# EAGLE schematic pca9635 (EAGLE 7.3.0)
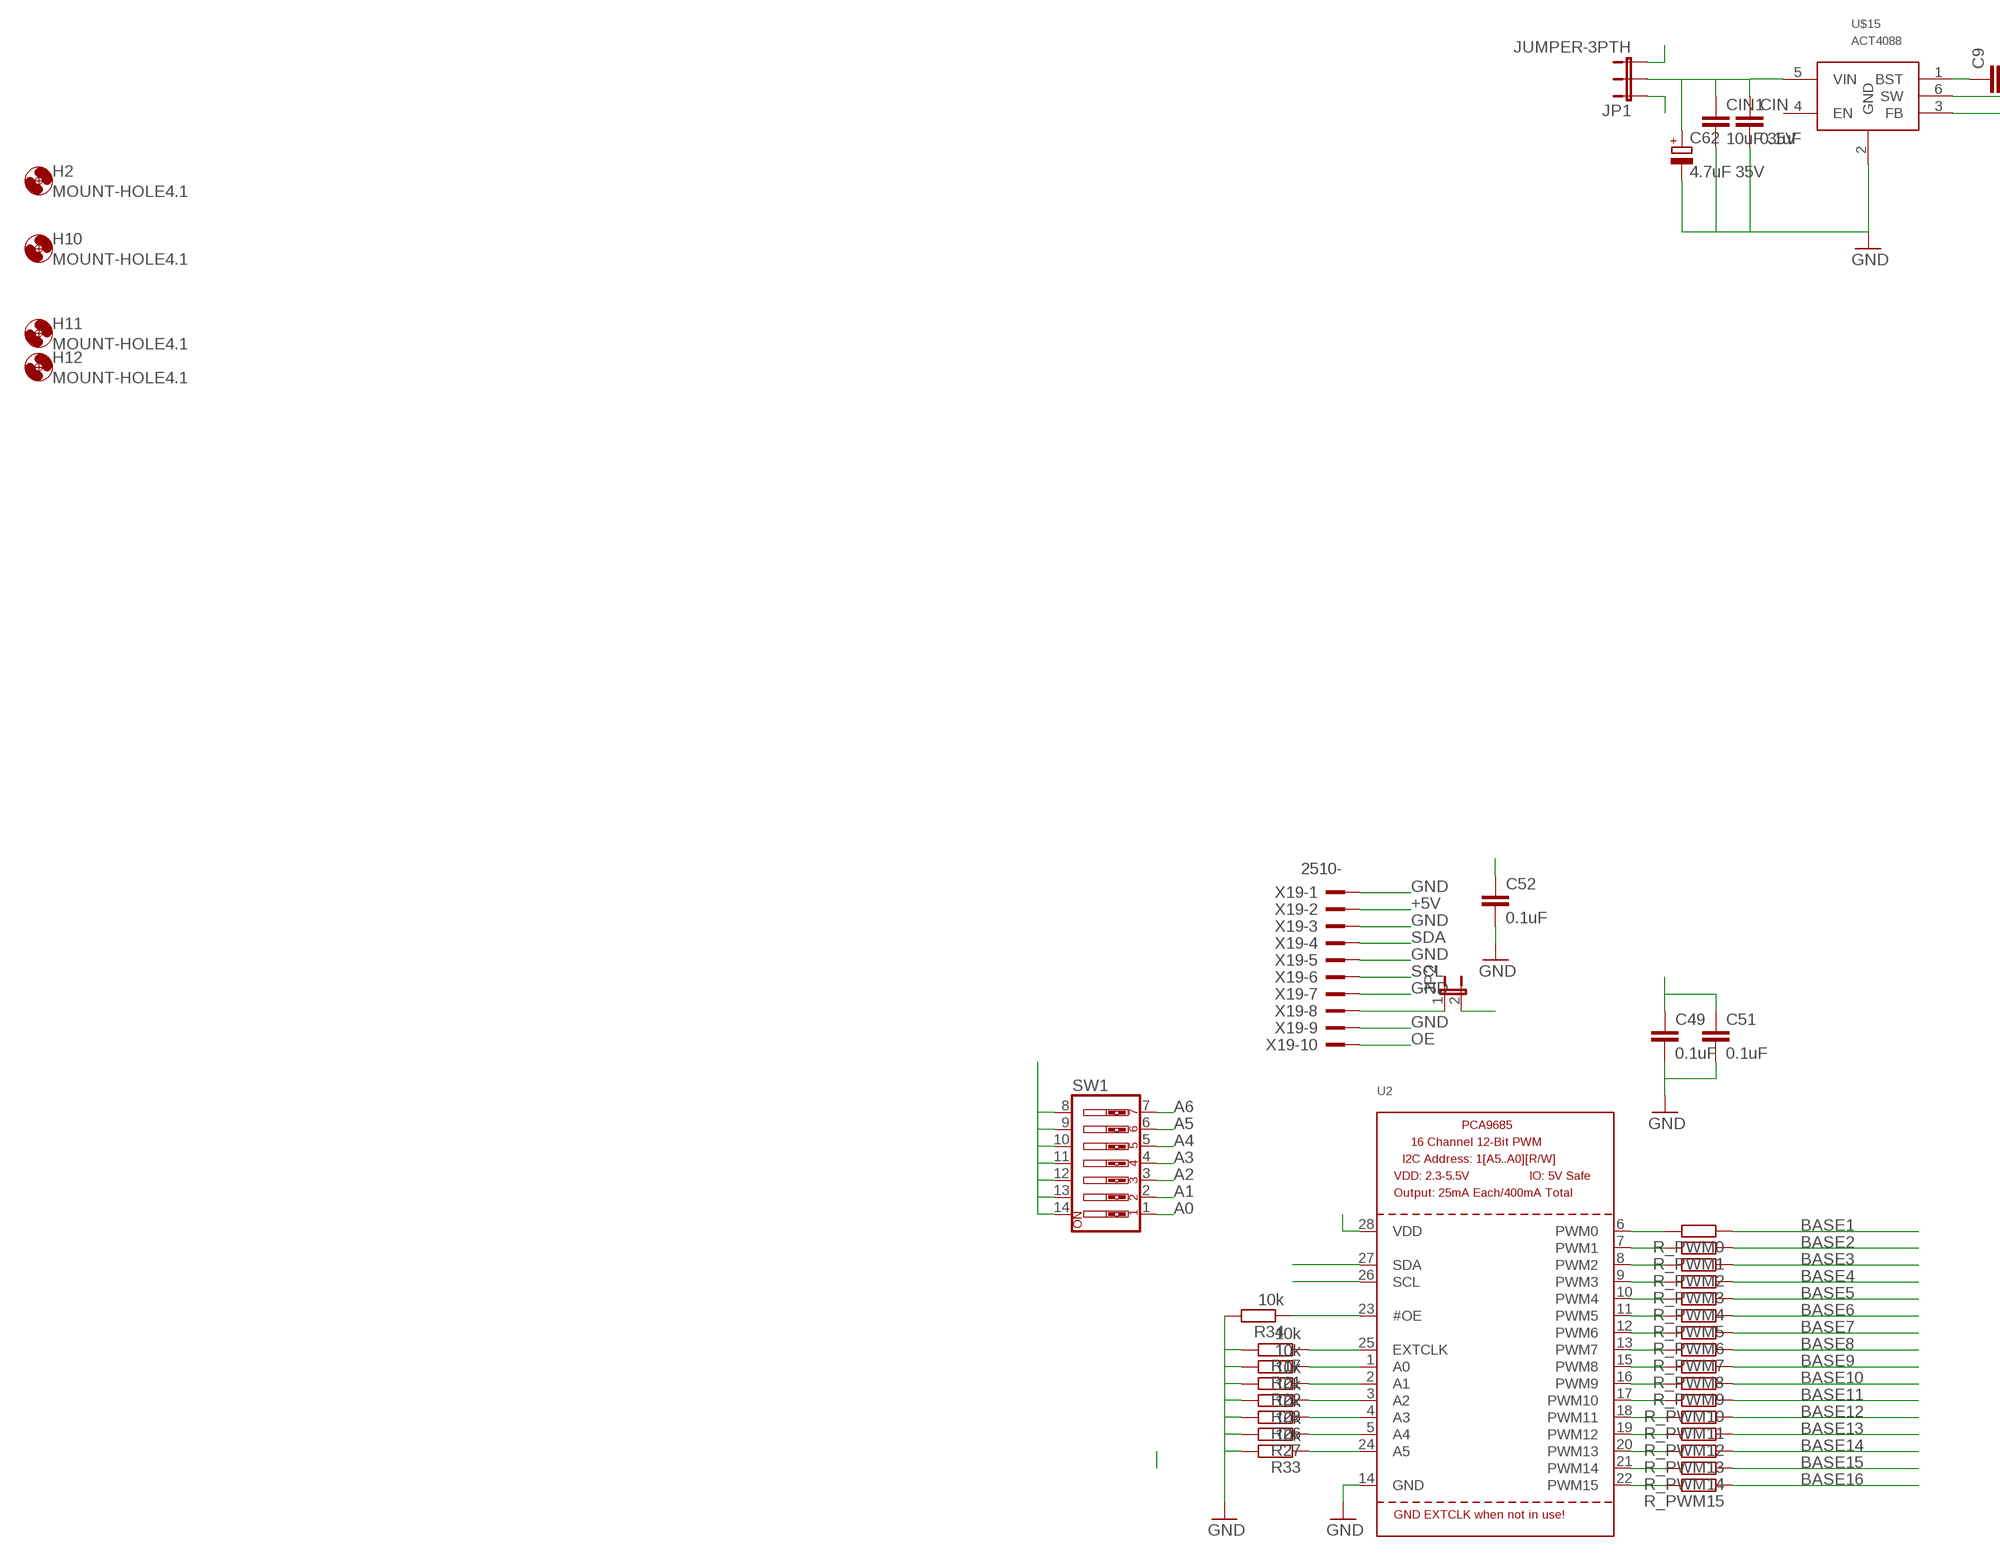
[diagram p0: schematic, sheet 1, part 1 of 2]
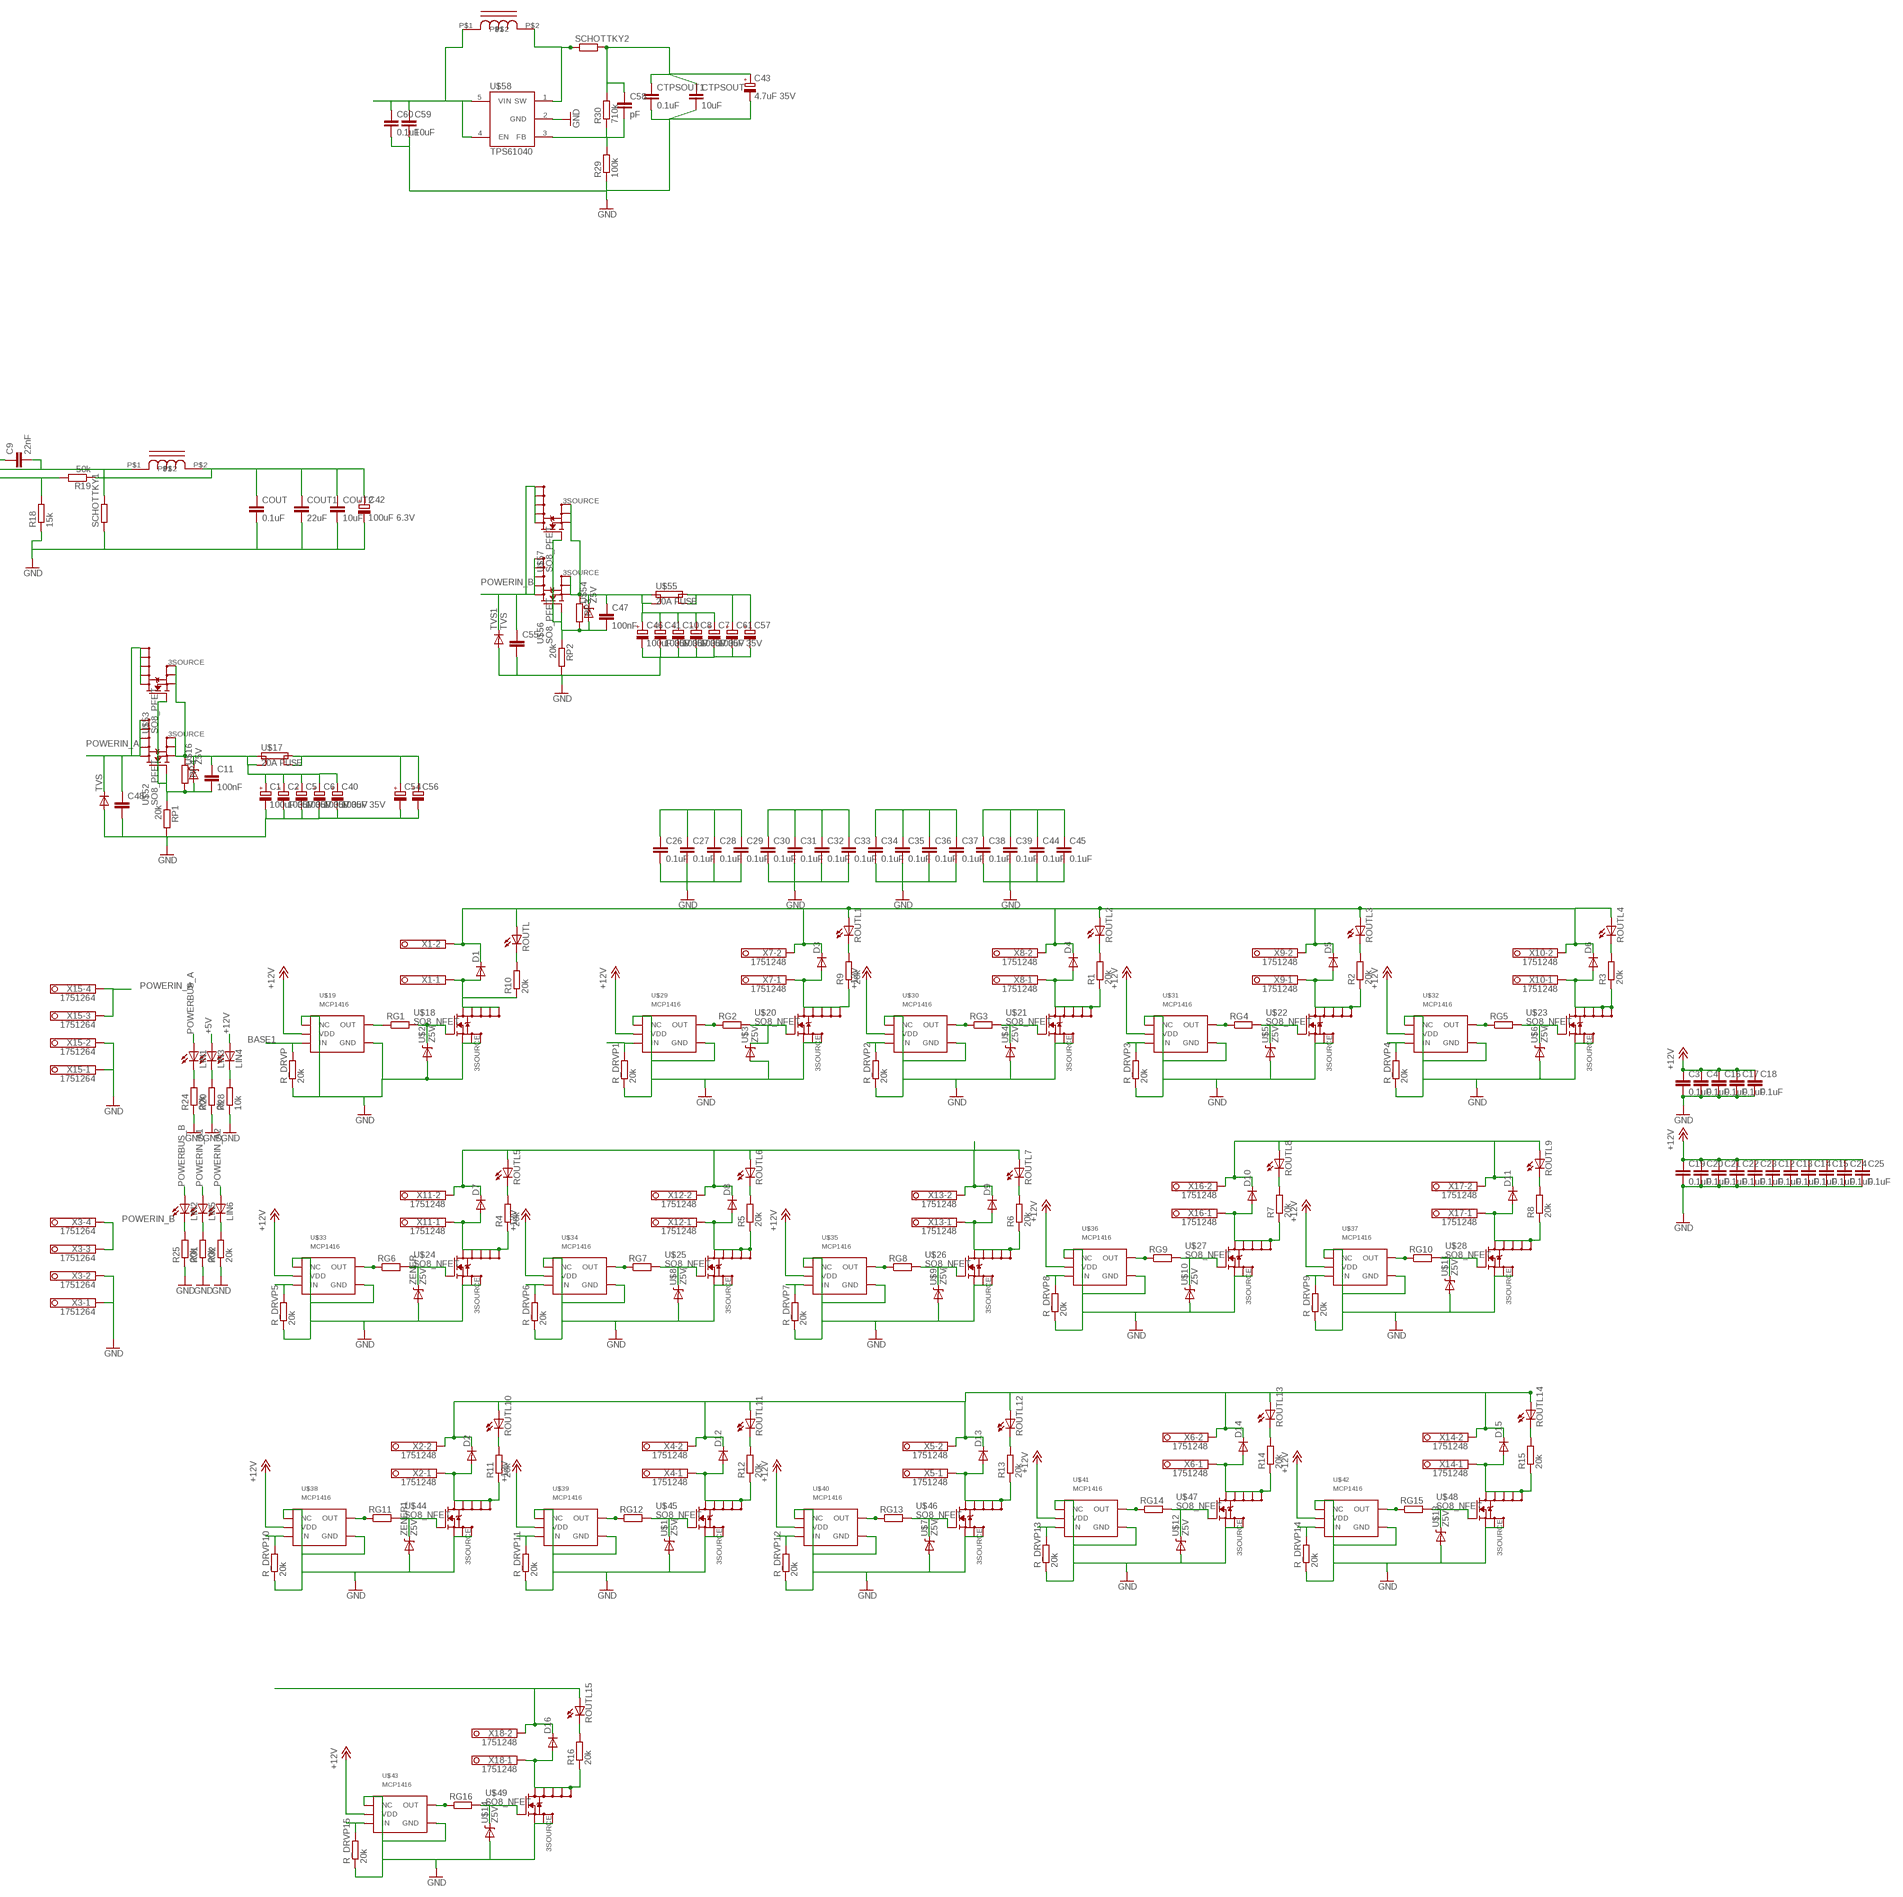
[diagram p1: schematic, sheet 1, part 2 of 2]

## Parts
C1  100uF 35V  CPOL-EUSMD_8X10_3.5HOLE  [SMD_8X10_3.5HOLE]
C2  100uF 35V  CPOL-EUSMD_8X10_3.5HOLE  [SMD_8X10_3.5HOLE]
C3  0.1uF  C-EUC0603  [C0603]
C4  0.1uF  C-EUC0603  [C0603]
C5  100uF 35V  CPOL-EUSMD_8X10_3.5HOLE  [SMD_8X10_3.5HOLE]
C6  100uF 35V  CPOL-EUSMD_8X10_3.5HOLE  [SMD_8X10_3.5HOLE]
C7  100uF 35V  CPOL-EUSMD_8X10_3.5HOLE  [SMD_8X10_3.5HOLE]
C8  100uF 35V  CPOL-EUSMD_8X10_3.5HOLE  [SMD_8X10_3.5HOLE]
C9  22nF  C-EUC0805  [C0805]
C10  100uF 35V  CPOL-EUSMD_8X10_3.5HOLE  [SMD_8X10_3.5HOLE]
C11  100nF  C-EUC0603  [C0603]
C12  0.1uF  C-EUC0603  [C0603]
C13  0.1uF  C-EUC0603  [C0603]
C14  0.1uF  C-EUC0603  [C0603]
C15  0.1uF  C-EUC0603  [C0603]
C16  0.1uF  C-EUC0603  [C0603]
C17  0.1uF  C-EUC0603  [C0603]
C18  0.1uF  C-EUC0603  [C0603]
C19  0.1uF  C-EUC0603  [C0603]
C20  0.1uF  C-EUC0603  [C0603]
C21  0.1uF  C-EUC0603  [C0603]
C22  0.1uF  C-EUC0603  [C0603]
C23  0.1uF  C-EUC0603  [C0603]
C24  0.1uF  C-EUC0603  [C0603]
C25  0.1uF  C-EUC0603  [C0603]
C26  0.1uF  C-EUC0603  [C0603]
C27  0.1uF  C-EUC0603  [C0603]
C28  0.1uF  C-EUC0603  [C0603]
C29  0.1uF  C-EUC0603  [C0603]
C30  0.1uF  C-EUC0603  [C0603]
C31  0.1uF  C-EUC0603  [C0603]
C32  0.1uF  C-EUC0603  [C0603]
C33  0.1uF  C-EUC0603  [C0603]
C34  0.1uF  C-EUC0603  [C0603]
C35  0.1uF  C-EUC0603  [C0603]
C36  0.1uF  C-EUC0603  [C0603]
C37  0.1uF  C-EUC0603  [C0603]
C38  0.1uF  C-EUC0603  [C0603]
C39  0.1uF  C-EUC0603  [C0603]
C40  100uF 35V  CPOL-EUSMD_8X10_3.5HOLE  [SMD_8X10_3.5HOLE]
C41  100uF 35V  CPOL-EUSMD_8X10_3.5HOLE  [SMD_8X10_3.5HOLE]
C42  100uF 6.3V  CPOL-EUUD-4X5,8  [UD-4X5,8_NICHICON]
C43  4.7uF 35V  CPOL-EUUD-4X5,8  [UD-4X5,8_NICHICON]
C44  0.1uF  C-EUC0603  [C0603]
C45  0.1uF  C-EUC0603  [C0603]
C46  100uF 35V  CPOL-EUSMD_8X10_3.5HOLE  [SMD_8X10_3.5HOLE]
C47  100nF  C-EUC0603  [C0603]
C48  C-EU050-055X075  [C050-055X075]
C49  0.1uF  C-EUC0603  [C0603]
C51  0.1uF  C-EUC0603  [C0603]
C52  0.1uF  C-EUC0603  [C0603]
C54  CPOL-EUUD-6,3X7,7  [UD-6,3X7,7_NICHICON]
C55  C-EU050-055X075  [C050-055X075]
C56  CPOL-EUUD-6,3X7,7  [UD-6,3X7,7_NICHICON]
C57  CPOL-EUUD-6,3X7,7  [UD-6,3X7,7_NICHICON]
C58  pF  C-EUC0603  [C0603]
C59  10uF  C-EUC1206  [C1206]
C60  0.1uF  C-EUC0603  [C0603]
C61  CPOL-EUUD-6,3X7,7  [UD-6,3X7,7_NICHICON]
C62  4.7uF 35V  CPOL-EUUD-4X5,8  [UD-4X5,8_NICHICON]
CIN  0.1uF  C-EUC0805  [C0805]
CIN1  10uF 35V  C-EUC1206  [C1206]
COUT  0.1uF  C-EUC0603  [C0603]
COUT1  22uF  C-EUC1210  [C1210]
COUT2  10uF  C-EUC1206  [C1206]
CTPSOUT  10uF  C-EUC1206  [C1206]
CTPSOUT1  0.1uF  C-EUC0805  [C0805]
D1  DIODESMA-ALT  [SMA-DIODE_ALT]
D2  DIODESMA-ALT  [SMA-DIODE_ALT]
D3  DIODESMA-ALT  [SMA-DIODE_ALT]
D4  DIODESMA-ALT  [SMA-DIODE_ALT]
D5  DIODESMA-ALT  [SMA-DIODE_ALT]
D6  DIODESMA-ALT  [SMA-DIODE_ALT]
D7  DIODESMA-ALT  [SMA-DIODE_ALT]
D8  DIODESMA-ALT  [SMA-DIODE_ALT]
D9  DIODESMA-ALT  [SMA-DIODE_ALT]
D10  DIODESMA-ALT  [SMA-DIODE_ALT]
D11  DIODESMA-ALT  [SMA-DIODE_ALT]
D12  DIODESMA-ALT  [SMA-DIODE_ALT]
D13  DIODESMA-ALT  [SMA-DIODE_ALT]
D14  DIODESMA-ALT  [SMA-DIODE_ALT]
D15  DIODESMA-ALT  [SMA-DIODE_ALT]
D16  DIODESMA-ALT  [SMA-DIODE_ALT]
H2  MOUNT-HOLE4.1  [4,1]
H10  MOUNT-HOLE4.1  [4,1]
H11  MOUNT-HOLE4.1  [4,1]
H12  MOUNT-HOLE4.1  [4,1]
JP1  JUMPER-3PTH  [1X03]
JP2  JUMPER-2SMD-NO  [SJ_2S-NO]
LIN1  LEDCHIP-LED0805  [CHIP-LED0805]
LIN2  LEDCHIP-LED0805  [CHIP-LED0805]
LIN3  LEDCHIP-LED0805  [CHIP-LED0805]
LIN4  LEDCHIP-LED0805  [CHIP-LED0805]
LIN5  LEDCHIP-LED0805  [CHIP-LED0805]
LIN6  LEDCHIP-LED0805  [CHIP-LED0805]
R1  20k  R-EU_R0603  [R0603]
R2  20k  R-EU_R0603  [R0603]
R3  20k  R-EU_R0603  [R0603]
R4  20k  R-EU_R0603  [R0603]
R5  20k  R-EU_R0603  [R0603]
R6  20k  R-EU_R0603  [R0603]
R7  20k  R-EU_R0603  [R0603]
R8  20k  R-EU_R0603  [R0603]
R9  20k  R-EU_R0603  [R0603]
R10  20k  R-EU_R0603  [R0603]
R11  20k  R-EU_R0603  [R0603]
R12  20k  R-EU_R0603  [R0603]
R13  20k  R-EU_R0603  [R0603]
R14  20k  R-EU_R0603  [R0603]
R15  20k  R-EU_R0603  [R0603]
R16  20k  R-EU_R0603  [R0603]
R17  10k  R-EU_R0603  [R0603]
R18  15k  R-EU_R0603  [R0603]
R19  50k  R-EU_R0603  [R0603]
R20  2k  R-EU_R0603  [R0603]
R21  10k  R-EU_R0603  [R0603]
R22  10k  R-EU_R0603  [R0603]
R23  10k  R-EU_R0603  [R0603]
R24  20k  R-EU_R0603  [R0603]
R25  20k  R-EU_R0603  [R0603]
R26  10k  R-EU_R0603  [R0603]
R27  10k  R-EU_R0603  [R0603]
R28  10k  R-EU_R0603  [R0603]
R29  100k  R-EU_R0603  [R0603]
R30  710k  R-EU_R0603  [R0603]
R31  20k  R-EU_R0603  [R0603]
R32  20k  R-EU_R0603  [R0603]
R33  10k  R-EU_R0603  [R0603]
R34  10k  R-EU_R0603  [R0603]
R_DRVP  20k  R-EU_R0603  [R0603]
R_DRVP1  20k  R-EU_R0603  [R0603]
R_DRVP2  20k  R-EU_R0603  [R0603]
R_DRVP3  20k  R-EU_R0603  [R0603]
R_DRVP4  20k  R-EU_R0603  [R0603]
R_DRVP5  20k  R-EU_R0603  [R0603]
R_DRVP6  20k  R-EU_R0603  [R0603]
R_DRVP7  20k  R-EU_R0603  [R0603]
R_DRVP8  20k  R-EU_R0603  [R0603]
R_DRVP9  20k  R-EU_R0603  [R0603]
R_DRVP10  20k  R-EU_R0603  [R0603]
R_DRVP11  20k  R-EU_R0603  [R0603]
R_DRVP12  20k  R-EU_R0603  [R0603]
R_DRVP13  20k  R-EU_R0603  [R0603]
R_DRVP14  20k  R-EU_R0603  [R0603]
R_DRVP15  20k  R-EU_R0603  [R0603]
R_PWM0  R-EU_R0603  [R0603]
R_PWM1  R-EU_R0603  [R0603]
R_PWM2  R-EU_R0603  [R0603]
R_PWM3  R-EU_R0603  [R0603]
R_PWM4  R-EU_R0603  [R0603]
R_PWM5  R-EU_R0603  [R0603]
R_PWM6  R-EU_R0603  [R0603]
R_PWM7  R-EU_R0603  [R0603]
R_PWM8  R-EU_R0603  [R0603]
R_PWM9  R-EU_R0603  [R0603]
R_PWM10  R-EU_R0603  [R0603]
R_PWM11  R-EU_R0603  [R0603]
R_PWM12  R-EU_R0603  [R0603]
R_PWM13  R-EU_R0603  [R0603]
R_PWM14  R-EU_R0603  [R0603]
R_PWM15  R-EU_R0603  [R0603]
RG1  R-EU_R0603  [R0603]
RG2  R-EU_R0603  [R0603]
RG3  R-EU_R0603  [R0603]
RG4  R-EU_R0603  [R0603]
RG5  R-EU_R0603  [R0603]
RG6  R-EU_R0603  [R0603]
RG7  R-EU_R0603  [R0603]
RG8  R-EU_R0603  [R0603]
RG9  R-EU_R0603  [R0603]
RG10  R-EU_R0603  [R0603]
RG11  R-EU_R0603  [R0603]
RG12  R-EU_R0603  [R0603]
RG13  R-EU_R0603  [R0603]
RG14  R-EU_R0603  [R0603]
RG15  R-EU_R0603  [R0603]
RG16  R-EU_R0603  [R0603]
ROUTL  LEDCHIP-LED0805  [CHIP-LED0805]
ROUTL1  LEDCHIP-LED0805  [CHIP-LED0805]
ROUTL2  LEDCHIP-LED0805  [CHIP-LED0805]
ROUTL3  LEDCHIP-LED0805  [CHIP-LED0805]
ROUTL4  LEDCHIP-LED0805  [CHIP-LED0805]
ROUTL5  LEDCHIP-LED0805  [CHIP-LED0805]
ROUTL6  LEDCHIP-LED0805  [CHIP-LED0805]
ROUTL7  LEDCHIP-LED0805  [CHIP-LED0805]
ROUTL8  LEDCHIP-LED0805  [CHIP-LED0805]
ROUTL9  LEDCHIP-LED0805  [CHIP-LED0805]
ROUTL10  LEDCHIP-LED0805  [CHIP-LED0805]
ROUTL11  LEDCHIP-LED0805  [CHIP-LED0805]
ROUTL12  LEDCHIP-LED0805  [CHIP-LED0805]
ROUTL13  LEDCHIP-LED0805  [CHIP-LED0805]
ROUTL14  LEDCHIP-LED0805  [CHIP-LED0805]
ROUTL15  LEDCHIP-LED0805  [CHIP-LED0805]
RP1  20k  R-EU_R0603  [R0603]
RP2  20k  R-EU_R0603  [R0603]
RP3  R-EU_R0603  [R0603]
RP4  R-EU_R0603  [R0603]
SCHOTTKY1  R-EU_R1206  [R1206]
SCHOTTKY2  R-EU_R1206  [R1206]
SW1  SW_DIP-7  [EDG-07]
TVS  DIODE-SMC  [SMC]
TVS1  TVS  DIODE-SMC  [SMC]
U2  PCA9685  [TSSOP28]
U$1  Z5V  DIODE-ZENER-BZT52  [SOD-323]
U$2  Z5V  DIODE-ZENER-BZT52  [SOD-323]
U$3  Z5V  DIODE-ZENER-BZT52  [SOD-323]
U$4  Z5V  DIODE-ZENER-BZT52  [SOD-323]
U$5  Z5V  DIODE-ZENER-BZT52  [SOD-323]
U$6  Z5V  DIODE-ZENER-BZT52  [SOD-323]
U$7  Z5V  DIODE-ZENER-BZT52  [SOD-323]
U$8  Z5V  DIODE-ZENER-BZT52  [SOD-323]
U$9  Z5V  DIODE-ZENER-BZT52  [SOD-323]
U$10  Z5V  DIODE-ZENER-BZT52  [SOD-323]
U$11  Z5V  DIODE-ZENER-BZT52  [SOD-323]
U$12  Z5V  DIODE-ZENER-BZT52  [SOD-323]
U$13  Z5V  DIODE-ZENER-BZT52  [SOD-323]
U$14  Z5V  DIODE-ZENER-BZT52  [SOD-323]
U$15  ACT4088  [SOT23-6]
U$16  Z5V  DIODE-ZENER-BZT52  [SOD-323]
U$17  20A FUSE  MINI-BLADE-297-9973564  [FUSE-3564-297-997]
U$18  SO8_NFET  N_MOSFET-SO8  [POWER-SO8]
U$19  MCP1416  [SOT23-5]
U$20  SO8_NFET  N_MOSFET-SO8  [POWER-SO8]
U$21  SO8_NFET  N_MOSFET-SO8  [POWER-SO8]
U$22  SO8_NFET  N_MOSFET-SO8  [POWER-SO8]
U$23  SO8_NFET  N_MOSFET-SO8  [POWER-SO8]
U$24  SO8_NFET  N_MOSFET-SO8  [POWER-SO8]
U$25  SO8_NFET  N_MOSFET-SO8  [POWER-SO8]
U$26  SO8_NFET  N_MOSFET-SO8  [POWER-SO8]
U$27  SO8_NFET  N_MOSFET-SO8  [POWER-SO8]
U$28  SO8_NFET  N_MOSFET-SO8  [POWER-SO8]
U$29  MCP1416  [SOT23-5]
U$30  MCP1416  [SOT23-5]
U$31  MCP1416  [SOT23-5]
U$32  MCP1416  [SOT23-5]
U$33  MCP1416  [SOT23-5]
U$34  MCP1416  [SOT23-5]
U$35  MCP1416  [SOT23-5]
U$36  MCP1416  [SOT23-5]
U$37  MCP1416  [SOT23-5]
U$38  MCP1416  [SOT23-5]
U$39  MCP1416  [SOT23-5]
U$40  MCP1416  [SOT23-5]
U$41  MCP1416  [SOT23-5]
U$42  MCP1416  [SOT23-5]
U$43  MCP1416  [SOT23-5]
U$44  SO8_NFET  N_MOSFET-SO8  [POWER-SO8]
U$45  SO8_NFET  N_MOSFET-SO8  [POWER-SO8]
U$46  SO8_NFET  N_MOSFET-SO8  [POWER-SO8]
U$47  SO8_NFET  N_MOSFET-SO8  [POWER-SO8]
U$48  SO8_NFET  N_MOSFET-SO8  [POWER-SO8]
U$49  SO8_NFET  N_MOSFET-SO8  [POWER-SO8]
U$52  SO8_PFET  N_MOSFET-SO8  [POWER-SO8]
U$53  SO8_PFET  N_MOSFET-SO8  [POWER-SO8]
U$54  Z5V  DIODE-ZENER-BZT52  [SOD-323]
U$55  20A FUSE  MINI-BLADE-297-9973564  [FUSE-3564-297-997]
U$56  SO8_PFET  N_MOSFET-SO8  [POWER-SO8]
U$57  SO8_PFET  N_MOSFET-SO8  [POWER-SO8]
U$58  TPS61040  V_REG_TPS61040SMD  [SOT23-5]
U$59  L1212  INDUCTOR-1212  [1212]
U$60  L1212  INDUCTOR-1212  [1212]
X1  1751248  [1751248]
X2  1751248  [1751248]
X3  1751264  [1751264]
X4  1751248  [1751248]
X5  1751248  [1751248]
X6  1751248  [1751248]
X7  1751248  [1751248]
X8  1751248  [1751248]
X9  1751248  [1751248]
X10  1751248  [1751248]
X11  1751248  [1751248]
X12  1751248  [1751248]
X13  1751248  [1751248]
X14  1751248  [1751248]
X15  1751264  [1751264]
X16  1751248  [1751248]
X17  1751248  [1751248]
X18  1751248  [1751248]
X19  2510-  [PAK100/2500-10]
ZENER  Z5V  DIODE-ZENER-BZT52  [SOD-323]
ZENER1  Z5V  DIODE-ZENER-BZT52  [SOD-323]

## Nets
+5V: C42.+ C49.1 C51.1 C52.1 C59.1 C60.1 COUT1.1 COUT2.1 COUT.1 LIN3.A R19.1 SW1.8 SW1.9 SW1.10 SW1.11 SW1.12 SW1.13 SW1.14 U2.28(VDD) U$58.4(EN) U$58.5(VIN) U$59.P$1 U$60.P$2 X19.2
+12V: C3.1 C4.1 C12.1 C13.1 C14.1 C15.1 C16.1 C17.1 C18.1 C19.1 C20.1 C21.1 C22.1 C23.1 C24.1 C25.1 C43.+ C58.1 CTPSOUT1.1 CTPSOUT.1 LIN4.A R30.2 SCHOTTKY2.2 U$19.2(VDD) U$29.2(VDD) U$30.2(VDD) U$31.2(VDD) U$32.2(VDD) U$33.2(VDD) U$34.2(VDD) U$35.2(VDD) U$36.2(VDD) U$37.2(VDD) U$38.2(VDD) U$39.2(VDD) U$40.2(VDD) U$41.2(VDD) U$42.2(VDD) U$43.2(VDD)
A0: R21.1 SW1.1 U2.1(A0)
A1: R22.1 SW1.2 U2.2(A1)
A2: R23.1 SW1.3 U2.3(A2)
A3: R26.1 SW1.4 U2.4(A3)
A4: R27.1 SW1.5 U2.5(A4)
A5: R33.1 SW1.6 U2.24(A5)
A6: JP2.2 R17.1 SW1.7 U2.25(EXTCLK)
BASE1: R_DRVP.2 R_PWM0.1 U$19.3(IN)
BASE2: R_DRVP1.2 R_PWM1.1 U$29.3(IN)
BASE3: R_DRVP2.2 R_PWM2.1 U$30.3(IN)
BASE4: R_DRVP3.2 R_PWM3.1 U$31.3(IN)
BASE5: R_DRVP4.2 R_PWM4.1 U$32.3(IN)
BASE6: R_DRVP5.2 R_PWM5.1 U$33.3(IN)
BASE7: R_DRVP6.2 R_PWM6.1 U$34.3(IN)
BASE8: R_DRVP7.2 R_PWM7.1 U$35.3(IN)
BASE9: R_DRVP8.2 R_PWM8.1 U$36.3(IN)
BASE10: R_DRVP9.2 R_PWM9.1 U$37.3(IN)
BASE11: R_DRVP10.2 R_PWM10.1 U$38.3(IN)
BASE12: R_DRVP11.2 R_PWM11.1 U$39.3(IN)
BASE13: R_DRVP12.2 R_PWM12.1 U$40.3(IN)
BASE14: R_DRVP13.2 R_PWM13.1 U$41.3(IN)
BASE15: R_DRVP14.2 R_PWM14.1 U$42.3(IN)
BASE16: R_DRVP15.2 R_PWM15.1 U$43.3(IN)
EXTCLK: JP2.1 X19.8
GND: C1.- C1.-1(-) C2.- C2.-1(-) C3.2 C4.2 C5.- C5.-1(-) C6.- C6.-1(-) C7.- C7.-1(-) C8.- C8.-1(-) C10.- C10.-1(-) C12.2 C13.2 C14.2 C15.2 C16.2 C17.2 C18.2 C19.2 C20.2 C21.2 C22.2 C23.2 C24.2 C25.2 C26.2 C27.2 C28.2 C29.2 C30.2 C31.2 C32.2 C33.2 C34.2 C35.2 C36.2 C37.2 C38.2 C39.2 C40.- C40.-1(-) C41.- C41.-1(-) C42.- C43.- C44.2 C45.2 C46.- C46.-1(-) C48.2 C49.2 C51.2 C52.2 C54.- C55.2 C56.- C57.- C59.2 C60.2 C61.- C62.- CIN1.2 CIN.2 COUT1.2 COUT2.2 COUT.2 CTPSOUT1.2 CTPSOUT.2 R17.2 R18.1 R20.1 R21.2 R22.2 R23.2 R24.1 R25.1 R26.2 R27.2 R28.1 R29.1 R31.1 R32.1 R33.2 R34.2 R_DRVP1.1 R_DRVP2.1 R_DRVP3.1 R_DRVP4.1 R_DRVP5.1 R_DRVP6.1 R_DRVP7.1 R_DRVP8.1 R_DRVP9.1 R_DRVP10.1 R_DRVP11.1 R_DRVP12.1 R_DRVP13.1 R_DRVP14.1 R_DRVP15.1 R_DRVP.1 RP1.2 RP2.2 SCHOTTKY1.1 TVS1.A TVS.A U2.14(GND) U$1.2(A) U$2.2(A) U$3.2(A) U$4.2(A) U$5.2(A) U$6.2(A) U$7.2(A) U$8.2(A) U$9.2(A) U$10.2(A) U$11.2(A) U$12.2(A) U$13.2(A) U$14.2(A) U$15.2(GND) U$18.1SOURCE(S1) U$18.2SOURCE(S2) U$18.3SOURCE(S3) U$19.1(NC) U$19.4(GND) U$20.1SOURCE(S1) U$20.2SOURCE(S2) U$20.3SOURCE(S3) U$21.1SOURCE(S1) U$21.2SOURCE(S2) U$21.3SOURCE(S3) U$22.1SOURCE(S1) U$22.2SOURCE(S2) U$22.3SOURCE(S3) U$23.1SOURCE(S1) U$23.2SOURCE(S2) U$23.3SOURCE(S3) U$24.1SOURCE(S1) U$24.2SOURCE(S2) U$24.3SOURCE(S3) U$25.1SOURCE(S1) U$25.2SOURCE(S2) U$25.3SOURCE(S3) U$26.1SOURCE(S1) U$26.2SOURCE(S2) U$26.3SOURCE(S3) U$27.1SOURCE(S1) U$27.2SOURCE(S2) U$27.3SOURCE(S3) U$28.1SOURCE(S1) U$28.2SOURCE(S2) U$28.3SOURCE(S3) U$29.1(NC) U$29.4(GND) U$30.1(NC) U$30.4(GND) U$31.1(NC) U$31.4(GND) U$32.1(NC) U$32.4(GND) U$33.1(NC) U$33.4(GND) U$34.1(NC) U$34.4(GND) U$35.1(NC) U$35.4(GND) U$36.1(NC) U$36.4(GND) U$37.1(NC) U$37.4(GND) U$38.1(NC) U$38.4(GND) U$39.1(NC) U$39.4(GND) U$40.1(NC) U$40.4(GND) U$41.1(NC) U$41.4(GND) U$42.1(NC) U$42.4(GND) U$43.1(NC) U$43.4(GND) U$44.1SOURCE(S1) U$44.2SOURCE(S2) U$44.3SOURCE(S3) U$45.1SOURCE(S1) U$45.2SOURCE(S2) U$45.3SOURCE(S3) U$46.1SOURCE(S1) U$46.2SOURCE(S2) U$46.3SOURCE(S3) U$47.1SOURCE(S1) U$47.2SOURCE(S2) U$47.3SOURCE(S3) U$48.1SOURCE(S1) U$48.2SOURCE(S2) U$48.3SOURCE(S3) U$49.1SOURCE(S1) U$49.2SOURCE(S2) U$49.3SOURCE(S3) U$58.2(GND) X3.1 X3.2 X15.1 X15.2 X19.1 X19.3 X19.5 X19.7 X19.9 ZENER1.2(A) ZENER.2(A)
N$1: D1.A R10.1 U$18.5DRAIN(D5) U$18.6DRAIN(D6) U$18.7DRAIN(D7) U$18.8DRAIN(D8) U$18.PAD_DRAIN(DPAD) X1.1
N$2: R10.2 ROUTL.C
N$3: D2.A R11.1 U$44.5DRAIN(D5) U$44.6DRAIN(D6) U$44.7DRAIN(D7) U$44.8DRAIN(D8) U$44.PAD_DRAIN(DPAD) X2.1
N$4: RG11.2 U$44.4GATE(G) ZENER1.1(C)
N$5: LIN3.C R20.2
N$6: D12.A R12.1 U$45.5DRAIN(D5) U$45.6DRAIN(D6) U$45.7DRAIN(D7) U$45.8DRAIN(D8) U$45.PAD_DRAIN(DPAD) X4.1
N$7: RG12.2 U$1.1(C) U$45.4GATE(G)
N$8: R1.2 ROUTL2.C
N$9: D13.A R13.1 U$46.5DRAIN(D5) U$46.6DRAIN(D6) U$46.7DRAIN(D7) U$46.8DRAIN(D8) U$46.PAD_DRAIN(DPAD) X5.1
N$10: RG13.2 U$7.1(C) U$46.4GATE(G)
N$11: C47.2 RP2.1 RP3.2 U$54.2(A) U$56.4GATE(G) U$57.4GATE(G)
N$12: D14.A R14.1 U$47.5DRAIN(D5) U$47.6DRAIN(D6) U$47.7DRAIN(D7) U$47.8DRAIN(D8) U$47.PAD_DRAIN(DPAD) X6.1
N$13: RG14.2 U$12.1(C) U$47.4GATE(G)
N$14: R2.2 ROUTL3.C
N$15: LIN2.C R25.2
N$16: D15.A R15.1 U$48.5DRAIN(D5) U$48.6DRAIN(D6) U$48.7DRAIN(D7) U$48.8DRAIN(D8) U$48.PAD_DRAIN(DPAD) X14.1
N$17: RG15.2 U$13.1(C) U$48.4GATE(G)
N$18: LIN4.C R28.2
N$19: R_PWM0.2 U2.6(PWM0)
N$20: R_PWM1.2 U2.7(PWM1)
N$21: R_PWM15.2 U2.22(PWM15)
N$22: R_PWM14.2 U2.21(PWM14)
N$23: R_PWM13.2 U2.20(PWM13)
N$24: D16.A R16.1 U$49.5DRAIN(D5) U$49.6DRAIN(D6) U$49.7DRAIN(D7) U$49.8DRAIN(D8) U$49.PAD_DRAIN(DPAD) X18.1
N$25: RG16.2 U$14.1(C) U$49.4GATE(G)
N$26: R3.2 ROUTL4.C
N$27: R_PWM12.2 U2.19(PWM12)
N$28: R18.2 R19.2 U$15.3(FB)
N$29: C9.1 U$15.1(BST)
N$30: SCHOTTKY2.1 U$58.1(SW) U$59.P$2
N$31: LIN5.C R31.2
N$32: C58.2 R29.2 R30.1 U$58.3(FB)
N$33: LIN1.C R24.2
N$34: LIN6.C R32.2
N$37: C11.2 RP1.1 RP4.2 U$16.2(A) U$52.4GATE(G) U$53.4GATE(G)
N$39: RG1.1 U$19.5(OUT)
N$40: R_PWM11.2 U2.18(PWM11)
N$41: R_PWM10.2 U2.17(PWM10)
N$42: R_PWM9.2 U2.16(PWM9)
N$43: R_PWM8.2 U2.15(PWM8)
N$44: R_PWM7.2 U2.13(PWM7)
N$45: R_PWM6.2 U2.12(PWM6)
N$46: R_PWM5.2 U2.11(PWM5)
N$47: R_PWM4.2 U2.10(PWM4)
N$48: R_PWM3.2 U2.9(PWM3)
N$49: R_PWM2.2 U2.8(PWM2)
N$50: RG2.1 U$29.5(OUT)
N$51: RG3.1 U$30.5(OUT)
N$52: RG4.1 U$31.5(OUT)
N$53: D3.A R9.1 U$20.5DRAIN(D5) U$20.6DRAIN(D6) U$20.7DRAIN(D7) U$20.8DRAIN(D8) U$20.PAD_DRAIN(DPAD) X7.1
N$54: RG2.2 U$3.1(C) U$20.4GATE(G)
N$55: RG5.1 U$32.5(OUT)
N$56: RG6.1 U$33.5(OUT)
N$58: D4.A R1.1 U$21.5DRAIN(D5) U$21.6DRAIN(D6) U$21.7DRAIN(D7) U$21.8DRAIN(D8) U$21.PAD_DRAIN(DPAD) X8.1
N$59: RG7.1 U$34.5(OUT)
N$60: RG8.1 U$35.5(OUT)
N$61: RG3.2 U$4.1(C) U$21.4GATE(G)
N$62: R4.2 ROUTL5.C
N$63: RG9.1 U$36.5(OUT)
N$64: RG10.1 U$37.5(OUT)
N$65: RG1.2 U$2.1(C) U$18.4GATE(G)
N$66: RG4.2 U$5.1(C) U$22.4GATE(G)
N$67: RG11.1 U$38.5(OUT)
N$68: RG12.1 U$39.5(OUT)
N$70: D6.A R3.1 U$23.5DRAIN(D5) U$23.6DRAIN(D6) U$23.7DRAIN(D7) U$23.8DRAIN(D8) U$23.PAD_DRAIN(DPAD) X10.1
N$71: RG13.1 U$40.5(OUT)
N$72: RG14.1 U$41.5(OUT)
N$73: RG5.2 U$6.1(C) U$23.4GATE(G)
N$74: R5.2 ROUTL6.C
N$75: RG15.1 U$42.5(OUT)
N$76: RG16.1 U$43.5(OUT)
N$78: R9.2 ROUTL1.C
N$82: R6.2 ROUTL7.C
N$84: R7.2 ROUTL8.C
N$86: R8.2 ROUTL9.C
N$88: R11.2 ROUTL10.C
N$90: R12.2 ROUTL11.C
N$92: R13.2 ROUTL12.C
N$94: R14.2 ROUTL13.C
N$96: R15.2 ROUTL14.C
N$98: D10.A R7.1 U$27.5DRAIN(D5) U$27.6DRAIN(D6) U$27.7DRAIN(D7) U$27.8DRAIN(D8) U$27.PAD_DRAIN(DPAD) X16.1
N$99: R16.2 ROUTL15.C
N$100: RG9.2 U$10.1(C) U$27.4GATE(G)
N$102: D11.A R8.1 U$28.5DRAIN(D5) U$28.6DRAIN(D6) U$28.7DRAIN(D7) U$28.8DRAIN(D8) U$28.PAD_DRAIN(DPAD) X17.1
N$103: RG10.2 U$11.1(C) U$28.4GATE(G)
N$127: D7.A R4.1 U$24.5DRAIN(D5) U$24.6DRAIN(D6) U$24.7DRAIN(D7) U$24.8DRAIN(D8) U$24.PAD_DRAIN(DPAD) X11.1
N$141: RG6.2 U$24.4GATE(G) ZENER.1(C)
N$143: D8.A R5.1 U$25.5DRAIN(D5) U$25.6DRAIN(D6) U$25.7DRAIN(D7) U$25.8DRAIN(D8) U$25.PAD_DRAIN(DPAD) X12.1
N$144: RG7.2 U$8.1(C) U$25.4GATE(G)
N$146: D9.A R6.1 U$26.5DRAIN(D5) U$26.6DRAIN(D6) U$26.7DRAIN(D7) U$26.8DRAIN(D8) U$26.PAD_DRAIN(DPAD) X13.1
N$147: RG8.2 U$9.1(C) U$26.4GATE(G)
OE: R34.1 U2.23(#OE) X19.10
POWERBUS_A: C26.1 C27.1 C28.1 C29.1 C30.1 C31.1 C32.1 C33.1 C54.+ C56.+ D1.C D3.C D4.C D5.C D6.C D7.C D8.C D9.C JP1.3 LIN1.A ROUTL1.A ROUTL2.A ROUTL3.A ROUTL4.A ROUTL5.A ROUTL6.A ROUTL7.A ROUTL.A U$17.P$3(2A) U$17.P$4(2B) X1.2 X7.2 X8.2 X9.2 X10.2 X11.2 X12.2 X13.2
POWERBUS_B: C34.1 C35.1 C36.1 C37.1 C38.1 C39.1 C44.1 C45.1 C57.+ C61.+ D2.C D10.C D11.C D12.C D13.C D14.C D15.C D16.C JP1.1 LIN2.A ROUTL8.A ROUTL9.A ROUTL10.A ROUTL11.A ROUTL12.A ROUTL13.A ROUTL14.A ROUTL15.A U$55.P$3(2A) U$55.P$4(2B) X2.2 X4.2 X5.2 X6.2 X14.2 X16.2 X17.2 X18.2
POWERIN_A: C48.1 TVS.C U$52.5DRAIN(D5) U$52.6DRAIN(D6) U$52.7DRAIN(D7) U$52.8DRAIN(D8) U$52.PAD_DRAIN(DPAD) U$53.5DRAIN(D5) U$53.6DRAIN(D6) U$53.7DRAIN(D7) U$53.8DRAIN(D8) U$53.PAD_DRAIN(DPAD) X15.3 X15.4
POWERIN_A1: C1.+ C1.+2(+) C2.+ C2.+2(+) C5.+ C5.+2(+) C6.+ C6.+2(+) C11.1 C40.+ C40.+2(+) LIN5.A RP4.1 U$16.1(C) U$17.P$1(1A) U$17.P$2(1B) U$52.1SOURCE(S1) U$52.2SOURCE(S2) U$52.3SOURCE(S3) U$53.1SOURCE(S1) U$53.2SOURCE(S2) U$53.3SOURCE(S3)
POWERIN_A2: C7.+ C7.+2(+) C8.+ C8.+2(+) C10.+ C10.+2(+) C41.+ C41.+2(+) C46.+ C46.+2(+) C47.1 LIN6.A RP3.1 U$54.1(C) U$55.P$1(1A) U$55.P$2(1B) U$56.1SOURCE(S1) U$56.2SOURCE(S2) U$56.3SOURCE(S3) U$57.1SOURCE(S1) U$57.2SOURCE(S2) U$57.3SOURCE(S3)
POWERIN_B: C55.1 TVS1.C U$56.5DRAIN(D5) U$56.6DRAIN(D6) U$56.7DRAIN(D7) U$56.8DRAIN(D8) U$56.PAD_DRAIN(DPAD) U$57.5DRAIN(D5) U$57.6DRAIN(D6) U$57.7DRAIN(D7) U$57.8DRAIN(D8) U$57.PAD_DRAIN(DPAD) X3.3 X3.4
Q4: D5.A R2.1 U$22.5DRAIN(D5) U$22.6DRAIN(D6) U$22.7DRAIN(D7) U$22.8DRAIN(D8) U$22.PAD_DRAIN(DPAD) X9.1
SCL: U2.26(SCL) X19.6
SDA: U2.27(SDA) X19.4
SW: C9.2 SCHOTTKY1.2 U$15.6(SW) U$60.P$1
VIN: C62.+ CIN1.1 CIN.1 JP1.2 U$15.5(VIN)
Unconnected: U$15.4(EN)

## Library data of the parts
C1 C2 C5-C8 C10 C40 C41 C46 = wes:CPOL-EU: POLARIZED CAPACITOR, European symbol
C3 C4 C9 C11-C39 C44 C45 C47 C49 C51 C52 C58-C60 CIN CIN1 COUT COUT1 COUT2 CTPSOUT CTPSOUT1 = wes:C-EU: CAPACITOR, European symbol
C42 C43 C54 C56 C57 C61 C62 = rcl:CPOL-EU: POLARIZED CAPACITOR, European symbol
C48 C55 = rcl:C-EU: CAPACITOR, European symbol
D1-D16 = SparkFun-DiscreteSemi:DIODE: Diode These are standard reverse protection diodes and small signal diodes. SMA package can handle up to about 1A. SOD-323 can handle about 200mA. What the SOD-323 package when ordering, there are some mfgs out there that are 5-pin packages.
H2 H10-H12 = holes:MOUNT-HOLE: MOUNTING HOLE with drill center marker
JP1 = SparkFun-Passives:JUMPER-3
JP2 = SparkFun-Passives:JUMPER-2: Jumper Basic 0.1" spaced jumper. Use with breakaway headers.
LIN1-LIN6 ROUTL ROUTL1-ROUTL15 = adafruit:LED: LED OSRAM: - CHIPLED LG R971, LG N971, LY N971, LG Q971, LY Q971, LO R971, LY R971 LH N974, LH R974 LS Q976, LO Q976, LY Q976 LO Q996 - Hyper CHIPLED LW Q18S LB Q993, LB Q99A, LB R99A - SideLED LS A670, LO A670, LY A670, LG A670, LP A670 LB A673, LV A673, LT A673, LW A673 LH A674 LY A675 LS A676, LA A676, LO A676, LY A676, LW A676 LS A679, LY A679, LG A679 - Hyper Micro SIDELED® LS Y876, LA Y876, LO Y876, LY Y876 LT Y87S - SmartLED LW L88C, LW L88S LB L89C, LB L89S, LG L890 LS L89K, LO L89K, LY L89K LS L896, LA L896, LO L896, LY L896 - TOPLED LS T670, LO T670, LY T670, LG T670, LP T670 LSG T670, LSP T670, LSY T670, LOP T670, LYG T670 LG T671, LOG T671, LSG T671 LB T673, LV T673, LT T673, LW T673 LH T674 LS T676, LA T676, LO T676, LY T676, LB T676, LH T676, LSB T676, LW T676 LB T67C, LV T67C, LT T67C, LS T67K, LO T67K, LY T67K, LW E67C LS E67B, LA E67B, LO E67B, LY E67B, LB E67C, LV E67C, LT E67C LW T67C LS T679, LY T679, LG T679 LS T770, LO T770, LY T770, LG T770, LP T770 LB T773, LV T773, LT T773, LW T773 LH T774 LS E675, LA E675, LY E675, LS T675 LS T776, LA T776, LO T776, LY T776, LB T776 LHGB T686 LT T68C, LB T68C - Hyper Mini TOPLED® LB M676 - Mini TOPLED Santana® LG M470 LS M47K, LO M47K, LY M47K Source: http://www.osram.convergy.de/
R1-R34 R_DRVP R_DRVP1-R_DRVP15 R_PWM0 R_PWM1-R_PWM15 RG1-RG16 RP1-RP4 SCHOTTKY1 SCHOTTKY2 = wes:R-EU_: RESISTOR, European symbol
SW1 = special:SW_DIP-7: DIP SWITCH
TVS TVS1 = diode:DIODE-: DIODE
U2 = adafruit:PCA9685: PCA9685 - 16 Channel 12-Bit I2C PWM Controller 5.0V tolerant 16 channel, 12-bit I2C PWM controller with 25mA per output (max. 400mA total) Digikey: 568-5931-1-ND
U$1-U$14 U$16 U$54 ZENER ZENER1 = SparkFun-DiscreteSemi:DIODE-ZENER: Zener Diode Production Part - 8199 3.4V Zener Voltage
U$15 = wes:ACT4088
U$17 U$55 = wes:MINI-BLADE-297-997
U$18 U$20-U$28 U$44-U$49 U$52 U$53 U$56 U$57 = wes:N_MOSFET-SO8
U$19 U$29-U$43 = wes:MCP1416
U$58 = SparkFun-PowerIC:V_REG_TPS61040
U$59 U$60 = wes:INDUCTOR-1212
X1 X2 X4-X14 X16-X18 = wes:1751248: MKDS 1/ 2-3,5 Printklemme Nennstrom: 10 A Bemessungsspannung: 160 V Raster: 3,5 mm Polzahl: 2 Montageart: Löten Anschlussart: Schraubanschluss Anschlussrichtung vom Leiter zur Platine: 0° Source: http://eshop.phoenixcontact.com .. 1751248.pdf; OC_FARNELL: unknown; OC_NEWARK: unknown
X3 X15 = wes:1751264: MKDS 1/ 4-3,5 Printklemme Nennstrom: 10 A Bemessungsspannung: 160 V Raster: 3,5 mm Polzahl: 4 Montageart: Löten Anschlussart: Schraubanschluss Anschlussrichtung vom Leiter zur Platine: 0° Source: http://eshop.phoenixcontact.com .. 1751264.pdf; MPN: 1751264; OC_FARNELL: unknown; OC_NEWARK: 10R0934
X19 = con-3m:2510-: 3M (TM) Pak 100 4-Wall Header Source: 3M; MF: 3M; MPN: 2510-6002UB; OC_FARNELL: 9838244; OC_NEWARK: 46F4725